# EAGLE design Adafruit DS2484 I2C to 1-Wire Breakout (EAGLE 9.6.2)
COMPANY: ADAFRUIT INDUSTRIES; DRAWN: KTOWN; REV: A
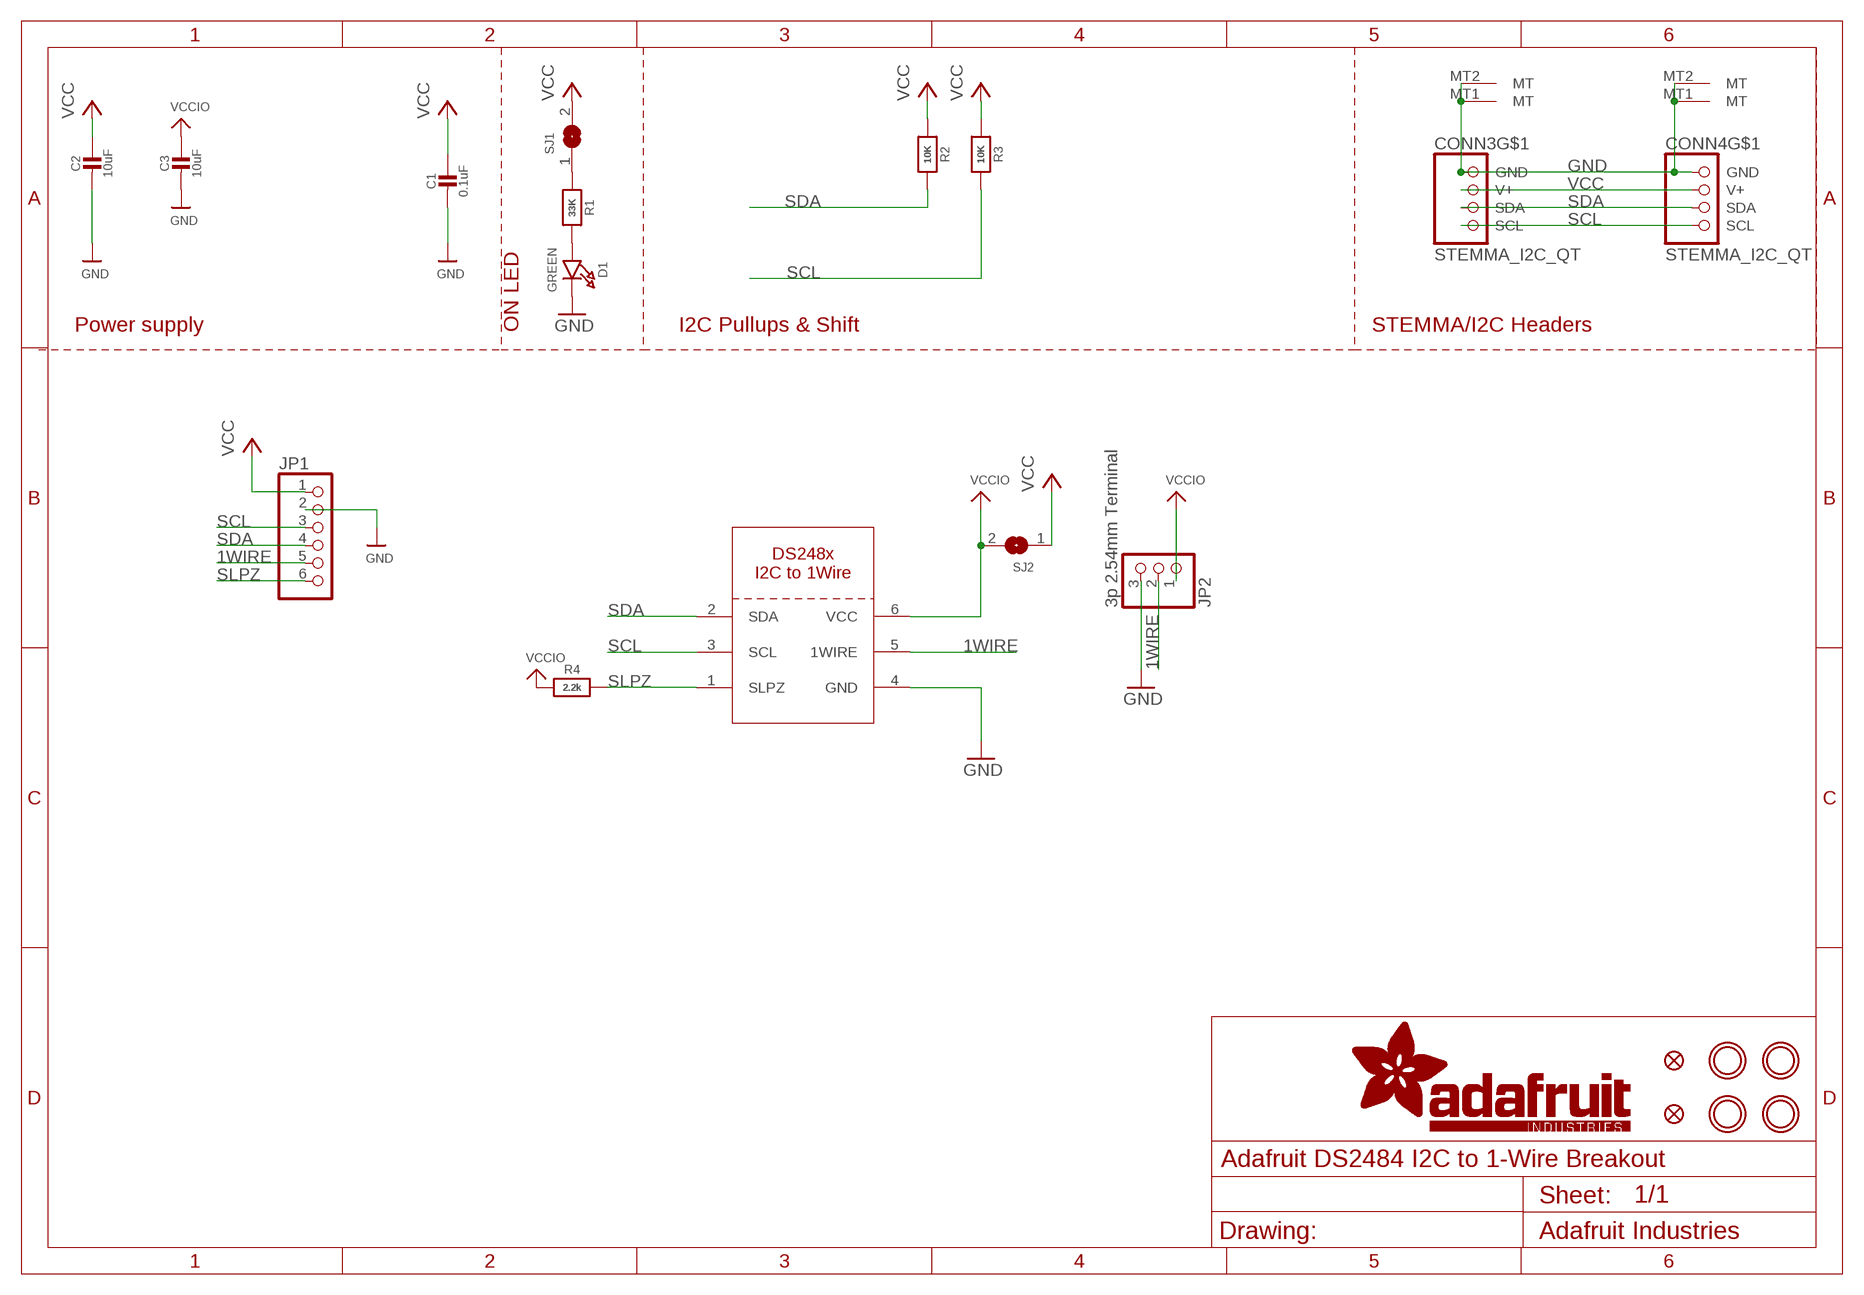
[diagram p0: schematic, sheet 1]

## Parts
C1  0.1uF  CAP_CERAMIC0603_NO  [0603-NO]
C2  10uF  CAP_CERAMIC0805-NOOUTLINE  [0805-NO]
C3  10uF  CAP_CERAMIC0805-NOOUTLINE  [0805-NO]
CONN3  STEMMA_I2C_QT  [JST_SH4]
CONN4  STEMMA_I2C_QT  [JST_SH4]
D1  GREEN  LED0603_NOOUTLINE  [CHIPLED_0603_NOOUTLINE]
FID3  FIDUCIAL_0.5MM  [FIDUCIAL_0.5MM]
FID4  FIDUCIAL_0.5MM  [FIDUCIAL_0.5MM]
IC1  DS248XR  [SOT23-6]
JP1  HEADER-1X670MIL  [1X06_ROUND_70]
JP2  3p 2.54mm Terminal  HEADER-1X3_254TERM  [1X03_2.54MMTERMINAL]
R1  33K  RESISTOR_0603_NOOUT  [0603-NO]
R2  10K  RESISTOR_0603_NOOUT  [0603-NO]
R3  10K  RESISTOR_0603_NOOUT  [0603-NO]
R4  2.2k  RESISTOR_0603_NOOUT  [0603-NO]
SJ1  SOLDERJUMPERCLOSED  [SOLDERJUMPER_CLOSEDWIRE]
SJ2  SOLDERJUMPERCLOSED  [SOLDERJUMPER_CLOSEDWIRE]
U$1  MOUNTINGHOLE2.5  [MOUNTINGHOLE_2.5_PLATED]
U$17  MOUNTINGHOLE2.5  [MOUNTINGHOLE_2.5_PLATED]
U$19  MOUNTINGHOLE2.5  [MOUNTINGHOLE_2.5_PLATED]
U$21  MOUNTINGHOLE2.5  [MOUNTINGHOLE_2.5_PLATED]

## Nets
1WIRE: IC1.5(1WIRE) JP1.5 JP2.2
GND [highpower]: C1.2 C2.2 C3.2 CONN3.1(GND) CONN3.MT1(MT) CONN3.MT2(MT) CONN4.1(GND) CONN4.MT1(MT) CONN4.MT2(MT) D1.C IC1.4(GND) JP1.2 JP2.3
N$1: D1.A R1.2
N$2 [lowpower]: R1.1 SJ1.1
SCL: CONN3.4(SCL) CONN4.4(SCL) IC1.3(SCL) JP1.3 R3.2
SDA: CONN3.3(SDA) CONN4.3(SDA) IC1.2(SDA) JP1.4 R2.2
SLPZ: IC1.1(SLPZ) JP1.6 R4.2
VCC [highpower]: C1.1 C2.1 CONN3.2(V+) CONN4.2(V+) JP1.1 R2.1 R3.1 SJ1.2 SJ2.1
VCCIO [highpower]: C3.1 IC1.6(VCC) JP2.1 R4.1 SJ2.2

## Notes on the sheet
- Power supply | ON LED | I2C Pullups & Shift | STEMMA/I2C Headers

## Library data of the parts
C1-C3 = microbuilder:CAP_CERAMIC: Ceramic Capacitors For new designs, use the packages preceded by an '_' character since they are more reliable: The following footprints should be used on most boards: _0402 - Standard footprint for regular board layouts _0603 - Standard footprint for regular board layouts _0805 - Standard footprint for regular board layouts _1206 - Standard footprint for regular board layouts For extremely tight-pitch boards where space is at a premium, the following 'micro-pitch' footprints can be used (smaller pads, no silkscreen outline, etc.): _0402MP - Micro-pitch footprint for very dense/compact boards _0603MP - Micro-pitch footprint for very dense/compact boards _0805MP - Micro-pitch footprint for very dense/compact boards _1206MP - Micro-pitch footprint for very dense/compact boards
CONN3 CONN4 = adafruit_electromech:STEMMA_I2C; LCSC: C2845363
D1 = microbuilder:LED: LED 0603 - 0603 Surface Mount Package 2mA: Green LED - Low Power (3.9mcd, 2ma, 1.7Vf) - Digikey: 475-2709-2-ND Orange LED - Low Power (9.8mcd, 2ma, 1.8Vf) - Digikey: 475-1194-2-ND Red LED - Low Power (5mcd, 2ma, 1.8Vf) - Digikey: 475-1195-2-ND Yellow LED - Low Power (7mcd, 2ma, 1.8Vf) - Digikey: 475-1196-2-ND 5mA: Blue LED - Low Power (17mcd, 5ma, 2.9Vf) - Digikey: LNJ937W8CRACT-ND 0805 - 0805 Surface Mount Package 2mA: Red LED (8.8mcd, 2mA, 1.8Vf, Clear) - Low Power [Digikey: 475-2510-1-ND] Green LED (5mcd, 2mA, 1.8Vf, Clear) - Low Power [Digikey: 475-2730-1-ND] Yellow LED (11.3mcd, 2mA, 1.8Vf, Clear) - Low Power [Digikey: 475-2555-1-ND] 20mA: Red LED (104mcd, 20mA, Diffused) - LS R976 [Digikey: 475-1278-6-ND] Red LED (12mcd, 20mA, 2.0Vf, Clear) - APT2012EC [Digikey: 754-1128-1-ND] Green LED (15mcd, 20mA, 2.2Vf, Clear) - APT2012GC [Digikey: 754-1131-1-ND] Orange LED (160mcd, 20mA, 2.1Vf, Clear) - APT2012SECK [Digikey: 754-1130-1-ND] 1206 - 1206 Surface Mount Package Green LED (26mcd, 20mA, Diffused) - LG N971 [Digikey: 475-1407-6-ND] Red LED (15mcd, 20mA, Diffused) - LH N974 [Digikey: 475-1416-6-ND] Cree - Cree High-Power Surface Mount LEDs XPEBWT-L1-0000-00D50 - White 111lm 350mA 2.9Vf 6200K 110° XTEAWT-00-0000-00000LEE3 - White 114lm 350mA 2.85Vf 5000K 115° Everlight - Everlight 45-21 Series Surface Mount LEDs 45-21/QK2C-B2832AC2CB2/2T - Warm White 2000mcd 20mA 3.25Vf 3050K 120° 45-21/LK2C-B38452C4CB2/2T - Nuetral White 2000mcd 20mA 3.25Vf 4150K 120° 45-21/LK2C-B50634C6CB2/2T - Cold White 2200mcd 20mA 3.25Vf 5650K 120° PLCC2 Reverse Mount LS T77K-J1L2-1-0-2-R18-Z - Red 11.25mcd 2mA 1.8Vf 630nm 120° LO T77K-L1M2-24-Z - Orange 19.6mcd 2mA 1.8Vf 606nm 120° LY T77K-K2M1-26-Z - Yellow 15.7mcd 2mA 1.8Vf 587nm 120°; ROT: 270
FID3 FID4 = microbuilder:FIDUCIAL: Fiducial Alignment Points Various fiducial points for machine vision alignment.
IC1 = adafruit_sensor:DS248X
JP1 = microbuilder:HEADER-1X6: PIN HEADER
JP2 = microbuilder:HEADER-1X3: PIN HEADER
R1-R4 = microbuilder:RESISTOR: Resistors For new designs, use the packages preceded by an '_' character since they are more reliable: The following footprints should be used on most boards: _0402 - Standard footprint for regular board layouts _0603 - Standard footprint for regular board layouts _0805 - Standard footprint for regular board layouts _1206 - Standard footprint for regular board layouts For extremely tight-pitch boards where space is at a premium, the following 'micro-pitch' footprints can be used (smaller pads, no silkscreen outline, etc.): _0402MP - Micro-pitch footprint for very dense/compact boards _0603MP - Micro-pitch footprint for very dense/compact boards _0805MP - Micro-pitch footprint for very dense/compact boards _1206MP - Micro-pitch footprint for very dense/compact boards
SJ1 SJ2 = microbuilder:SOLDERJUMPER: SMD Solder JUMPER Solder the two pads together to create a connection, or remove the solder to break it. REFLOW - Use this footprint for solder paste and reflow ovens. WAVE - Use this footprint for hand-soldering (larger pads). CLOSED - Has a trace between the two pads to ensure it is closed by default. The trace needs to be cut to disable the jumper, and can be closed again by creating a solder bridge between the two pads.
U$1 U$17 U$19 U$21 = adafruit_electromech:MOUNTINGHOLE: Mounting Hole For #2 screws (0.086"/2.18mm width, 0.094"/2.4mm hole) use 2.5mm; BOM: EXCLUDE

## Net classes
1 highpower: width 0.305 mm, drill 0.483 mm
2 lowpower: width 0.254 mm, drill 0.483 mm

## Board
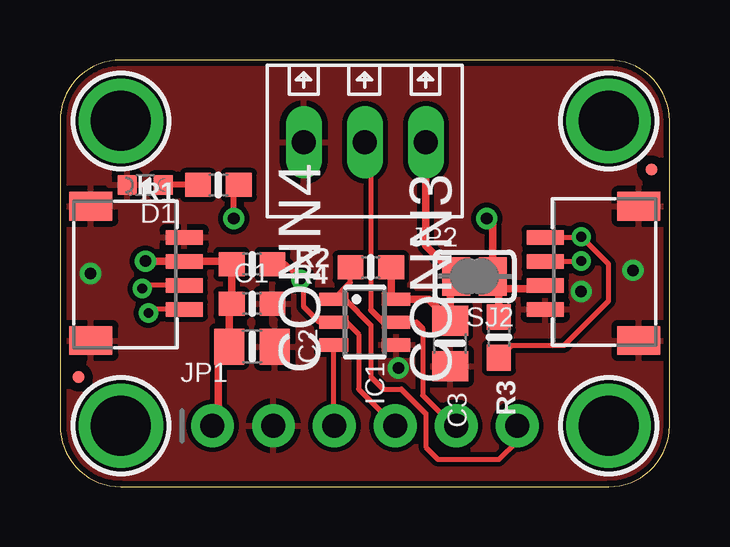
[diagram p1: board, top side]
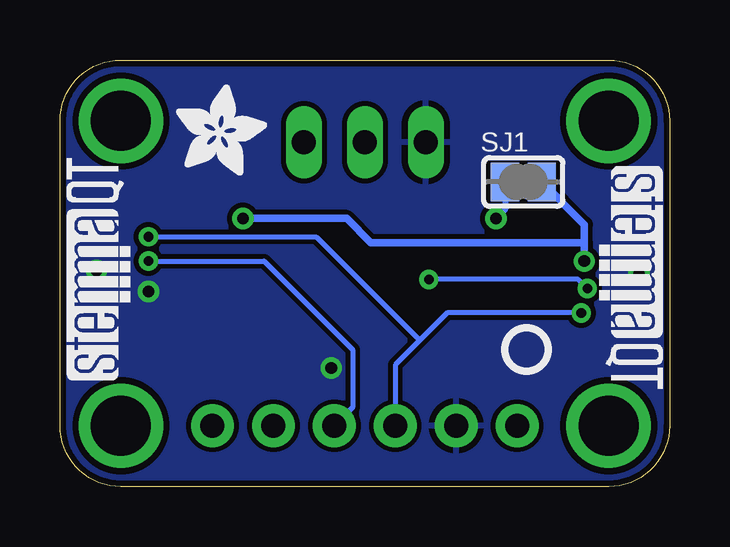
[diagram p2: board, bottom side, seen from below]

Size 25.4 x 17.78 mm. Coordinates in mm from the lower left corner, seen from the top.
Outline: 0,15.24 0,2.54 arc90 2.54,0 22.86,0 arc90 25.4,2.54 25.4,15.24 arc90 22.86,17.78 2.54,17.78 arc90 0,15.24
Copper layers (1*16): Top 0.035mm / dielectric 1.5mm / Bottom 0.035mm
Design rules "adafruit *": minimum track width 8mil, minimum drill 15.5mil, track to track 8mil, track to pad 8mil, pad to pad 8mil, via to via 8mil, smd to smd 8mil, copper to edge 10mil, drill to drill 8mil, minimum pad ring 10mil, minimum via ring 8mil, stop-mask expansion 2mil, vias tented up to drill 20mil, thermal gap 10mil

### Footprints (pad centres in the part's own frame; a part is rotated, then mirrored left to right if it is on the bottom)
0603-NO = smd 1.075 x 1: 1 -0.85,0; 2 0.85,0
0805-NO = smd 1.24 x 1.5: 1 -0.95,0; 2 0.95,0
JST_SH4 = smd 0.6 x 1.55: 1 -1.5,2.006; 2 -0.5,2.006; 3 0.5,2.006; 4 1.5,2.006 | smd 1.2 x 1.8: MT1 -2.8,-1.894; MT2 2.8,-1.894
CHIPLED_0603_NOOUTLINE = smd 0.8 x 0.8: A 0,-0.75; C 0,0.75
FIDUCIAL_0.5MM = smd 0.5 x 0.5: 1 0,0
SOT23-6 = smd 0.55 x 1.2: 1 -0.95,-1.3; 2 0,-1.3; 3 0.95,-1.3; 4 0.95,1.3; 5 0,1.3; 6 -0.95,1.3
1X06_ROUND_70 = drill 1 pad 1.778: 1 -6.35,0; 2 -3.81,0; 3 -1.27,0; 4 1.27,0; 5 3.81,0; 6 6.35,0
1X03_2.54MMTERMINAL = drill 1 long: 1 2.54,0; 2 0,0; 3 -2.54,0
SOLDERJUMPER_CLOSEDWIRE = smd 1.168 x 1.6: 1 -0.762,0; 2 0.762,0 | smd 0.635 x 0.203: WIRE 0,0
MOUNTINGHOLE_2.5_PLATED = drill 2.5 pad 3.2: P$1 0,0

### Placement (x,y rotation side)
C1  8,7.62 0 top
C2  8,5.84 0 top
C3  16.26,5.97 270 top
CONN3  22.23,8.89 90 top
CONN4  3.17,8.89 270 top
D1  3.56,12.57 90 top
FID3  0.76,4.57 0 top
FID4  24.64,13.21 0 top
IC1  12.7,6.86 270 top
JP1  12.7,2.54 0 top
JP2  12.7,14.35 0 top
PLABEL0  [PLABEL0]  6.35,0.89 0 top
PLABEL1  [PLABEL1]  8.89,4.19 0 top
PLABEL2  [PLABEL2]  11.43,0.89 0 top
PLABEL3  [PLABEL3]  13.97,4.19 0 top
PLABEL4  [PLABEL4]  16.64,0.89 0 top
PLABEL5  [PLABEL5]  19.05,4.19 0 top
PLABEL6  [PLABEL6]  4.7,15.37 0 top
PLABEL7  [PLABEL7]  17.02,14.86 0 top
PLABEL8  [PLABEL8]  0.38,12.45 0 top
PLABEL9  [PLABEL9]  9.91,10.54 0 top
PLABEL10  [PLABEL10]  12.83,10.54 0 top
PLABEL11  [PLABEL11]  15.75,10.54 0 top
PLABEL12  [PLABEL12]  12.83,11.43 0 bottom
PLABEL13  [PLABEL13]  12.83,8 0 bottom
PLABEL14  [PLABEL14]  12.7,0.89 0 bottom
PLABEL15  [PLABEL15]  6.1,14.61 0 bottom
PLABEL16  [PLABEL16]  12.95,4.83 0 bottom
PLABEL17  [PLABEL17]  8.64,16.76 0 bottom
PLABEL18  [PLABEL18]  12.7,16.76 0 bottom
PLABEL19  [PLABEL19]  15.88,16.76 0 bottom
R1  6.6,12.57 180 top
R2  8,9.27 0 top
R3  18.29,6.22 270 top
R4  12.95,9.14 180 top
SJ1  6.1,12.7 0 bottom
SJ2  17.27,8.76 180 top
U$1  2.54,15.24 0 top
U$17  22.86,15.24 0 top
U$19  2.54,2.54 0 top
U$21  22.86,2.54 0 top
U$22  [ADAFRUIT_3.5MM]  20.57,12.95 0 bottom
U$25  [PCBFEAT-REV-040]  5.97,5.71 0 bottom
U$30  [STEMMAQT]  22.48,4.45 90 bottom
U$31  [STEMMAQT]  2.92,13.34 270 bottom

### Tracks (layer width: path | path; a pad name or v marks a point on that pad's centre or on a via)
1WIRE
  Top 0.203: 12.95,14.1 12.95,7.37 | IC1.5 14.86,6.86 15.11,6.6 15.11,3.81 16.38,2.54 JP1.5
  Top 0.254: JP2.2 12.95,14.1 | IC1.5 13.46,6.86 12.95,7.37
GND  (via drill 0.48)
  other vias: 14.1,4.95 21.72,8.13 23.88,9.02 1.27,8.89
  pour Top: 0,17.78 25.4,17.78 25.4,0 0,0
  pour Bottom: 0,17.78 25.4,17.78 25.4,0 0,0
N$1
  Top 0.254: R1.2 D1.A
N$2  (via drill 0.48)
  Top 0.254: v7.24,11.18 7.24,12.36 R1.1
  Bottom 0.254: SJ1.1 6.86,11.56 v7.24,11.18
SCL  (via drill 0.4)
  Top 0.203: JP1.3 11.4,2.57 IC1.3 | CONN4.4 3.83,7.39 v3.68,7.24 | CONN3.4 21.69,10.39 v21.72,10.41 22.86,9.27 22.86,7.75 20.99,5.88 18.8,5.88 R3.2
  Bottom 0.203: v3.68,7.24 9.27,7.24 10.41,6.1 | JP1.3 11.43,5.08 10.41,6.1 | v21.72,10.41 14.73,10.41 10.41,6.1
SDA  (via drill 0.4)
  Top 0.203: JP1.4 12.45,4.06 12.45,6.35 11.94,6.86 IC1.2 10.79,6.86 10.16,7.49 10.16,8.51 v10.03,8.64 9.4,9.27 R2.2 | CONN4.3 3.56,8.39 v3.43,8.26 | CONN3.3 21.7,9.39 v21.72,9.4
  Bottom 0.203: v3.43,8.26 3.81,8.64 v10.03,8.64 | v21.72,9.4 16.9,9.4 13.21,5.71 13.21,3.3 JP1.4
SLPZ
  Top 0.203: JP1.6 19.05,1.91 18.29,1.14 15.75,1.14 15.24,1.65 15.24,3.05 14.22,4.06 13.46,4.06 12.95,4.57 12.95,6.73 11.88,7.81 IC1.1 12.1,8.51 R4.2
VCC  (via drill 0.48)
  Top 0.305: JP1.1 6.6,2.79 6.6,5.39 C2.1 7.05,7.52 C1.1 R2.1 7.03,9.39 CONN4.2 v3.56,9.39 v3.56,9.4 | R3.1 18.29,8.26 | 18.29,8.26 18.29,8.51 SJ2.1 18.03,10.92 v17.78,11.18 | CONN3.2 20.08,8.26 18.29,8.26
  Bottom 0.305: v3.56,9.4 3.56,10.16 | 3.56,10.16 3.56,10.92 SJ1.2 | 3.56,10.16 12.45,10.16 13.46,11.18 v17.78,11.18
VCCIO
  Top 0.305: JP2.1 15.24,10.03 SJ2.2 16.26,8.51 C3.1 15.37,7.81 IC1.6 13.8,8 R4.1

### Text on the board
Pinguin_tBackup: DS2 / 484 | I2C / to / 1Wire | on | GND | 1W | V+ | GND | SDA | SLPZ | VIN | SCL | 1WIRE
Pinguin_bBackup: GND | 1W | V+ | LED | DS2484 | I2C to 1-Wire / Converter | I2C Addr 0x18 | VLogic/Vcc: 3-5VDC